# EAGLE design trunsmeetur (EAGLE 9.2.2)
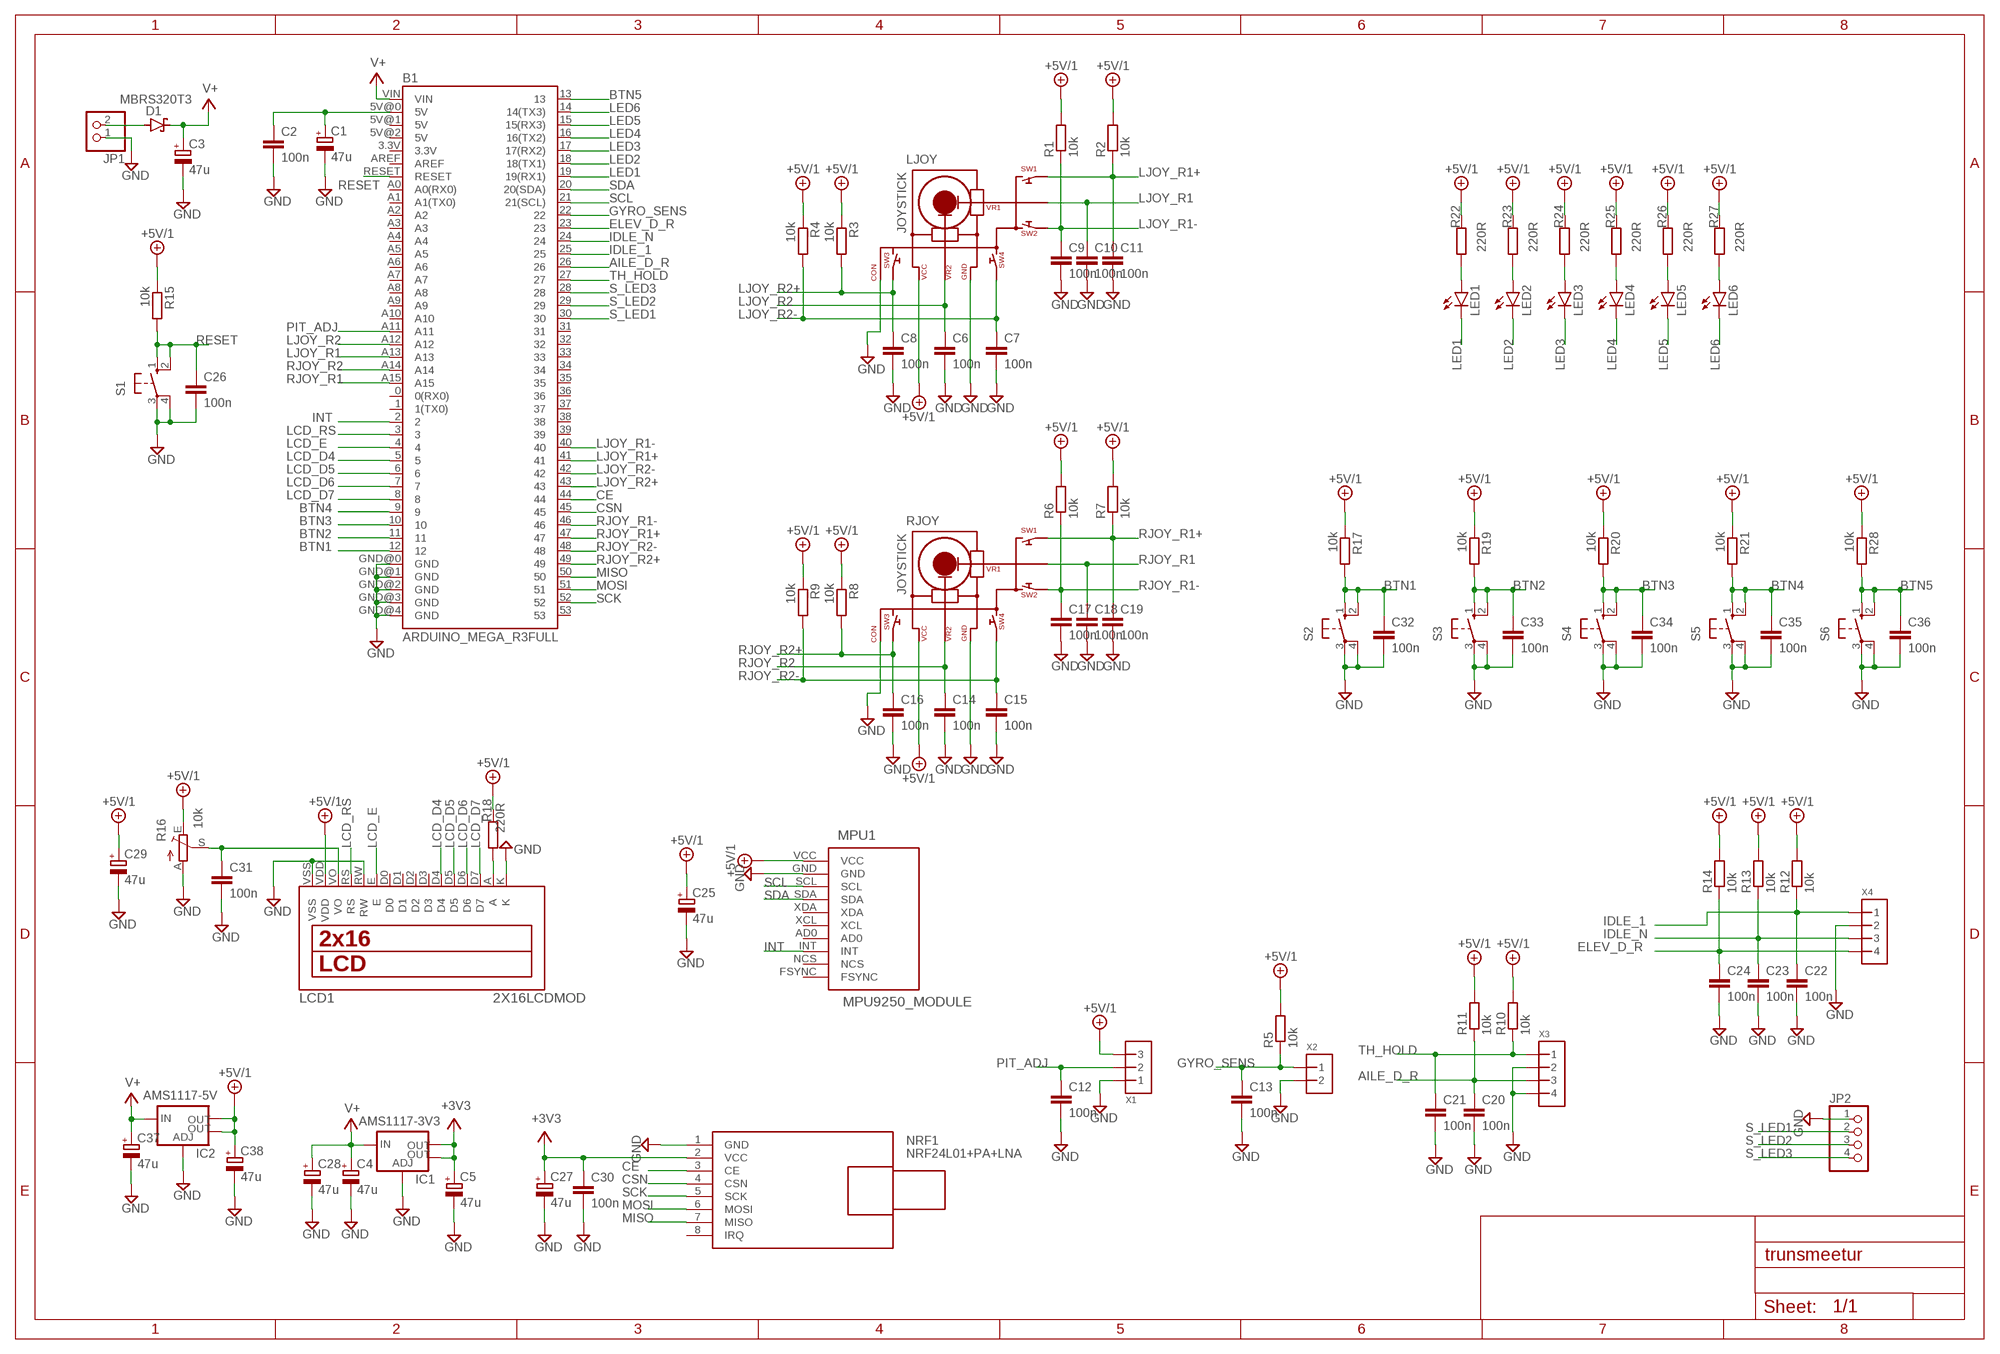
[diagram p0: schematic, sheet 1]

## Parts
B1  ARDUINO_MEGA_R3FULL  [ARDUINO_MEGA]
C1  47u  CPOL-EU153CLV-0605  [153CLV-0605]
C2  100n  C-EUC0805  [C0805]
C3  47u  CPOL-EU153CLV-0605  [153CLV-0605]
C4  47u  CPOL-EU153CLV-0605  [153CLV-0605]
C5  47u  CPOL-EU153CLV-0605  [153CLV-0605]
C6  100n  C-EUC0805  [C0805]
C7  100n  C-EUC0805  [C0805]
C8  100n  C-EUC0805  [C0805]
C9  100n  C-EUC0805  [C0805]
C10  100n  C-EUC0805  [C0805]
C11  100n  C-EUC0805  [C0805]
C12  100n  C-EUC0805  [C0805]
C13  100n  C-EUC0805  [C0805]
C14  100n  C-EUC0805  [C0805]
C15  100n  C-EUC0805  [C0805]
C16  100n  C-EUC0805  [C0805]
C17  100n  C-EUC0805  [C0805]
C18  100n  C-EUC0805  [C0805]
C19  100n  C-EUC0805  [C0805]
C20  100n  C-EUC0805  [C0805]
C21  100n  C-EUC0805  [C0805]
C22  100n  C-EUC0805  [C0805]
C23  100n  C-EUC0805  [C0805]
C24  100n  C-EUC0805  [C0805]
C25  47u  CPOL-EU153CLV-0605  [153CLV-0605]
C26  100n  C-EUC0805  [C0805]
C27  47u  CPOL-EU153CLV-0605  [153CLV-0605]
C28  47u  CPOL-EU153CLV-0605  [153CLV-0605]
C29  47u  CPOL-EU153CLV-0605  [153CLV-0605]
C30  100n  C-EUC0805  [C0805]
C31  100n  C-EUC0805  [C0805]
C32  100n  C-EUC0805  [C0805]
C33  100n  C-EUC0805  [C0805]
C34  100n  C-EUC0805  [C0805]
C35  100n  C-EUC0805  [C0805]
C36  100n  C-EUC0805  [C0805]
C37  47u  CPOL-EU153CLV-0605  [153CLV-0605]
C38  47u  CPOL-EU153CLV-0605  [153CLV-0605]
D1  MBRS320T3  [SMC]
IC1  AMS1117-3V3  V_REG_LM1117SOT223  [SOT223]
IC2  AMS1117-5V  V_REG_LM1117SOT223  [SOT223]
JP1  PINHD-1X2  [1X02]
JP2  PINHD-1X4  [1X04]
LCD1  2X16LCDMOD  [LCD16X2MOD]
LED1  LEDCHIPLED_0805  [CHIPLED_0805]
LED2  LEDCHIPLED_0805  [CHIPLED_0805]
LED3  LEDCHIPLED_0805  [CHIPLED_0805]
LED4  LEDCHIPLED_0805  [CHIPLED_0805]
LED5  LEDCHIPLED_0805  [CHIPLED_0805]
LED6  LEDCHIPLED_0805  [CHIPLED_0805]
LJOY  JOYSTICK  [JOYSTICKCONNECTOR]
MPU1  MPU9250_MODULE  [MPU9250_MODULE]
NRF1  NRF24L01+PA+LNA  WIRELESS-NRF24L01-PA-EXT  [WIRELESS-NRF24L01-PA-EXT]
R1  10k  R-EU_M0805  [M0805]
R2  10k  R-EU_M0805  [M0805]
R3  10k  R-EU_M0805  [M0805]
R4  10k  R-EU_M0805  [M0805]
R5  10k  R-EU_M0805  [M0805]
R6  10k  R-EU_M0805  [M0805]
R7  10k  R-EU_M0805  [M0805]
R8  10k  R-EU_M0805  [M0805]
R9  10k  R-EU_M0805  [M0805]
R10  10k  R-EU_M0805  [M0805]
R11  10k  R-EU_M0805  [M0805]
R12  10k  R-EU_M0805  [M0805]
R13  10k  R-EU_M0805  [M0805]
R14  10k  R-EU_M0805  [M0805]
R15  10k  R-EU_M0805  [M0805]
R16  10k  TRIM_EU-CA9V  [CA9V]
R17  10k  R-EU_M0805  [M0805]
R18  220R  R-EU_M0805  [M0805]
R19  10k  R-EU_M0805  [M0805]
R20  10k  R-EU_M0805  [M0805]
R21  10k  R-EU_M0805  [M0805]
R22  220R  R-EU_M0805  [M0805]
R23  220R  R-EU_M0805  [M0805]
R24  220R  R-EU_M0805  [M0805]
R25  220R  R-EU_M0805  [M0805]
R26  220R  R-EU_M0805  [M0805]
R27  220R  R-EU_M0805  [M0805]
R28  10k  R-EU_M0805  [M0805]
RJOY  JOYSTICK  [JOYSTICKCONNECTOR]
S1  10-XX  [B3F-10XX]
S2  10-XX  [B3F-10XX]
S3  10-XX  [B3F-10XX]
S4  10-XX  [B3F-10XX]
S5  10-XX  [B3F-10XX]
S6  10-XX  [B3F-10XX]
X1  3PIN  [3PINCONNECTOR]
X2  2PIN  [2PINCONNECTOR]
X3  4PIN  [4PINCONNECTOR]
X4  4PIN  [4PINCONNECTOR]

## Nets
+3V3: C5.+ C27.+ C30.1 IC1.2(OUT) IC1.4(OUT) NRF1.2(VCC)
+5V/1: C25.+ C29.+ C38.+ IC2.2(OUT) IC2.4(OUT) LCD1.VDD LJOY.VCC MPU1.VCC R1.2 R2.2 R3.1 R4.1 R5.2 R6.2 R7.2 R8.1 R9.1 R10.2 R11.2 R12.2 R13.2 R14.2 R15.1 R16.E R17.1 R18.1 R19.1 R20.1 R21.1 R22.1 R23.1 R24.1 R25.1 R26.1 R27.1 R28.1 RJOY.VCC X1.3
AILE_D_R: B1.26 C20.1 R11.1 X3.3
BTN1: B1.12 C32.1 R17.2 S2.1(S) S2.2(S1)
BTN2: B1.11 C33.1 R19.2 S3.1(S) S3.2(S1)
BTN3: B1.10 C34.1 R20.2 S4.1(S) S4.2(S1)
BTN4: B1.9 C35.1 R21.2 S5.1(S) S5.2(S1)
BTN5: B1.13 C36.1 R28.2 S6.1(S) S6.2(S1)
CE: B1.44 NRF1.3(CE)
CSN: B1.45 NRF1.4(CSN)
ELEV_D_R: B1.23 C24.1 R14.1 X4.4
GND: B1.GND@0(GND) B1.GND@1(GND) B1.GND@2(GND) B1.GND@3(GND) B1.GND@4(GND) C1.- C2.2 C3.- C4.- C5.- C6.2 C7.2 C8.2 C9.2 C10.2 C11.2 C12.2 C13.2 C14.2 C15.2 C16.2 C17.2 C18.2 C19.2 C20.2 C21.2 C22.2 C23.2 C24.2 C25.- C26.2 C27.- C28.- C29.- C30.2 C31.2 C32.2 C33.2 C34.2 C35.2 C36.2 C37.- C38.- IC1.1(ADJ) IC2.1(ADJ) JP1.1 JP2.1 LCD1.K LCD1.RW LCD1.VSS LJOY.CON LJOY.GND MPU1.GND NRF1.1(GND) R16.A RJOY.CON RJOY.GND S1.3(P) S1.4(P1) S2.3(P) S2.4(P1) S3.3(P) S3.4(P1) S4.3(P) S4.4(P1) S5.3(P) S5.4(P1) S6.3(P) S6.4(P1) X1.1 X2.2 X3.2 X3.4 X4.2
GYRO_SENS: B1.22 C13.1 R5.1 X2.1
IDLE_1: B1.25 C22.1 R12.1 X4.1
IDLE_N: B1.24 C23.1 R13.1 X4.3
INT: B1.2 MPU1.INT
LCD_D4: B1.5 LCD1.D4
LCD_D5: B1.6 LCD1.D5
LCD_D6: B1.7 LCD1.D6
LCD_D7: B1.8 LCD1.D7
LCD_E: B1.4 LCD1.E
LCD_RS: B1.3 LCD1.RS
LED1: B1.19(19(RX1)) LED1.C
LED2: B1.18(18(TX1)) LED2.C
LED3: B1.17(17(RX2)) LED3.C
LED4: B1.16(16(TX2)) LED4.C
LED5: B1.15(15(RX3)) LED5.C
LED6: B1.14(14(TX3)) LED6.C
LJOY_R1: B1.A13 C10.1 LJOY.VR1
LJOY_R1+: B1.41 C11.1 LJOY.SW1 R2.1
LJOY_R1-: B1.40 C9.1 LJOY.SW2 R1.1
LJOY_R2: B1.A12 C6.1 LJOY.VR2
LJOY_R2+: B1.43 C8.1 LJOY.SW3 R3.2
LJOY_R2-: B1.42 C7.1 LJOY.SW4 R4.2
MISO: B1.50 NRF1.7(MISO)
MOSI: B1.51 NRF1.6(MOSI)
N$1: C31.1 LCD1.VO R16.S
N$2: D1.A JP1.2
N$3: LCD1.A R18.2
N$4: LED1.A R22.2
N$5: LED2.A R23.2
N$6: LED3.A R24.2
N$7: LED4.A R25.2
N$8: LED5.A R26.2
N$9: LED6.A R27.2
N$19: B1.5V@0(5V) C1.+ C2.1
PIT_ADJ: B1.A11 C12.1 X1.2
RESET: B1.RESET C26.1 R15.2 S1.1(S) S1.2(S1)
RJOY_R1: B1.A15 C18.1 RJOY.VR1
RJOY_R1+: B1.47 C19.1 R7.1 RJOY.SW1
RJOY_R1-: B1.46 C17.1 R6.1 RJOY.SW2
RJOY_R2: B1.A14 C14.1 RJOY.VR2
RJOY_R2+: B1.49 C16.1 R8.2 RJOY.SW3
RJOY_R2-: B1.48 C15.1 R9.2 RJOY.SW4
S_LED1: B1.30 JP2.2
S_LED2: B1.29 JP2.3
S_LED3: B1.28 JP2.4
SCK: B1.52 NRF1.5(SCK)
SCL: B1.21(21(SCL)) MPU1.SCL
SDA: B1.20(20(SDA)) MPU1.SDA
TH_HOLD: B1.27 C21.1 R10.1 X3.1
V+: B1.VIN C3.+ C4.+ C28.+ C37.+ D1.C IC1.3(IN) IC2.3(IN)
Unconnected: B1.0(0(RX0)) B1.1(1(TX0)) B1.3.3V B1.5V@1(5V) B1.5V@2(5V) B1.31 B1.32 B1.33 B1.34 B1.35 B1.36 B1.37 B1.38 B1.39 B1.53 B1.A0(A0(RX0)) B1.A1(A1(TX0)) B1.A2 B1.A3 B1.A4 B1.A5 B1.A6 B1.A7 B1.A8 B1.A9 B1.A10 B1.AREF LCD1.D0 LCD1.D1 LCD1.D2 LCD1.D3 MPU1.AD0 MPU1.FSYNC MPU1.NCS MPU1.XCL MPU1.XDA NRF1.8(IRQ)

## Library data of the parts
B1 = SparkFun-Boards:ARDUINO_MEGA_R3: Arduino Mega R3 ATmega2560 R3 compatible footprint. SparkFun Products: Arduino Mega 2560 R3 <https://www.sparkfun.com/products/11061>
C1 C3-C5 C25 C27-C29 C37 C38 = rcl:CPOL-EU: POLARIZED CAPACITOR, European symbol; SPICEPREFIX: C
C2 C6-C24 C26 C30-C36 = rcl:C-EU: CAPACITOR, European symbol; SPICEPREFIX: C
D1 = diode:MBRS3*0T3: SCHOTTKY BARRIER RECTIFIER 3.0 AMPERES 20, 30, 40 VOLT Source: MBRS340T3-D.pdf
IC1 IC2 = SparkFun-IC-Power:V_REG_LM1117: Voltage Regulator LM1117 Standard adjustable voltage regulator but in SMD form. Spark Fun Electronics SKU : COM-00595; PROD_ID: VREG-08170
JP1 = pinhead:PINHD-1X2: PIN HEADER
JP2 = pinhead:PINHD-1X4: PIN HEADER
LCD1 = flightcontroller:2X16LCD
LED1-LED6 = led:LED: LED OSRAM: - CHIPLED LG R971, LG N971, LY N971, LG Q971, LY Q971, LO R971, LY R971 LH N974, LH R974 LS Q976, LO Q976, LY Q976 LO Q996 - Hyper CHIPLED LW Q18S LB Q993, LB Q99A, LB R99A - SideLED LS A670, LO A670, LY A670, LG A670, LP A670 LB A673, LV A673, LT A673, LW A673 LH A674 LY A675 LS A676, LA A676, LO A676, LY A676, LW A676 LS A679, LY A679, LG A679 - Hyper Micro SIDELED® LS Y876, LA Y876, LO Y876, LY Y876 LT Y87S - SmartLED LW L88C, LW L88S LB L89C, LB L89S, LG L890 LS L89K, LO L89K, LY L89K LS L896, LA L896, LO L896, LY L896 - TOPLED LS T670, LO T670, LY T670, LG T670, LP T670 LSG T670, LSP T670, LSY T670, LOP T670, LYG T670 LG T671, LOG T671, LSG T671 LB T673, LV T673, LT T673, LW T673 LH T674 LS T676, LA T676, LO T676, LY T676, LB T676, LH T676, LSB T676, LW T676 LB T67C, LV T67C, LT T67C, LS T67K, LO T67K, LY T67K, LW E67C LS E67B, LA E67B, LO E67B, LY E67B, LB E67C, LV E67C, LT E67C LW T67C LS T679, LY T679, LG T679 LS T770, LO T770, LY T770, LG T770, LP T770 LB T773, LV T773, LT T773, LW T773 LH T774 LS E675, LA E675, LY E675, LS T675 LS T776, LA T776, LO T776, LY T776, LB T776 LHGB T686 LT T68C, LB T68C - Hyper Mini TOPLED® LB M676 - Mini TOPLED Santana® LG M470 LS M47K, LO M47K, LY M47K Source: http://www.osram.convergy.de LUXEON: - LUMILED® LXK2-PW12-R00, LXK2-PW12-S00, LXK2-PW14-U00, LXK2-PW14-V00 LXK2-PM12-R00, LXK2-PM12-S00, LXK2-PM14-U00 LXK2-PE12-Q00, LXK2-PE12-R00, LXK2-PE12-S00, LXK2-PE14-T00, LXK2-PE14-U00 LXK2-PB12-K00, LXK2-PB12-L00, LXK2-PB12-M00, LXK2-PB14-N00, LXK2-PB14-P00, LXK2-PB14-Q00 LXK2-PR12-L00, LXK2-PR12-M00, LXK2-PR14-Q00, LXK2-PR14-R00 LXK2-PD12-Q00, LXK2-PD12-R00, LXK2-PD12-S00 LXK2-PH12-R00, LXK2-PH12-S00 LXK2-PL12-P00, LXK2-PL12-Q00, LXK2-PL12-R00 Source: www.luxeon.com KINGBRIGHT: KA-3528ASYC Source: www.kingbright.com
LJOY RJOY = flightcontroller:JOYSTICK
MPU1 = flightcontroller:MPU9250_MODULE
NRF1 = diy-modules:WIRELESS-NRF24L01-PA-EXT: 2.4 GHz Wireless Module based on NRF24L01 chip with preamplifier and external antenna Click here to find device on ebay.com <http://www.ebay.com/sch/nrf24l01+pa+lna+sma>
R1-R15 R17-R28 = rcl:R-EU_: RESISTOR, European symbol; SPICEPREFIX: R
R16 = pot:TRIM_EU-: POTENTIOMETER
S1-S6 = switch-omron:10-XX: OMRON SWITCH; MPN: B3F-1000; OC_FARNELL: 176432; OC_NEWARK: 36M3542
X1 = flightcontroller:3PIN
X2 = flightcontroller:2PIN
X3 X4 = flightcontroller:4PIN

## Board
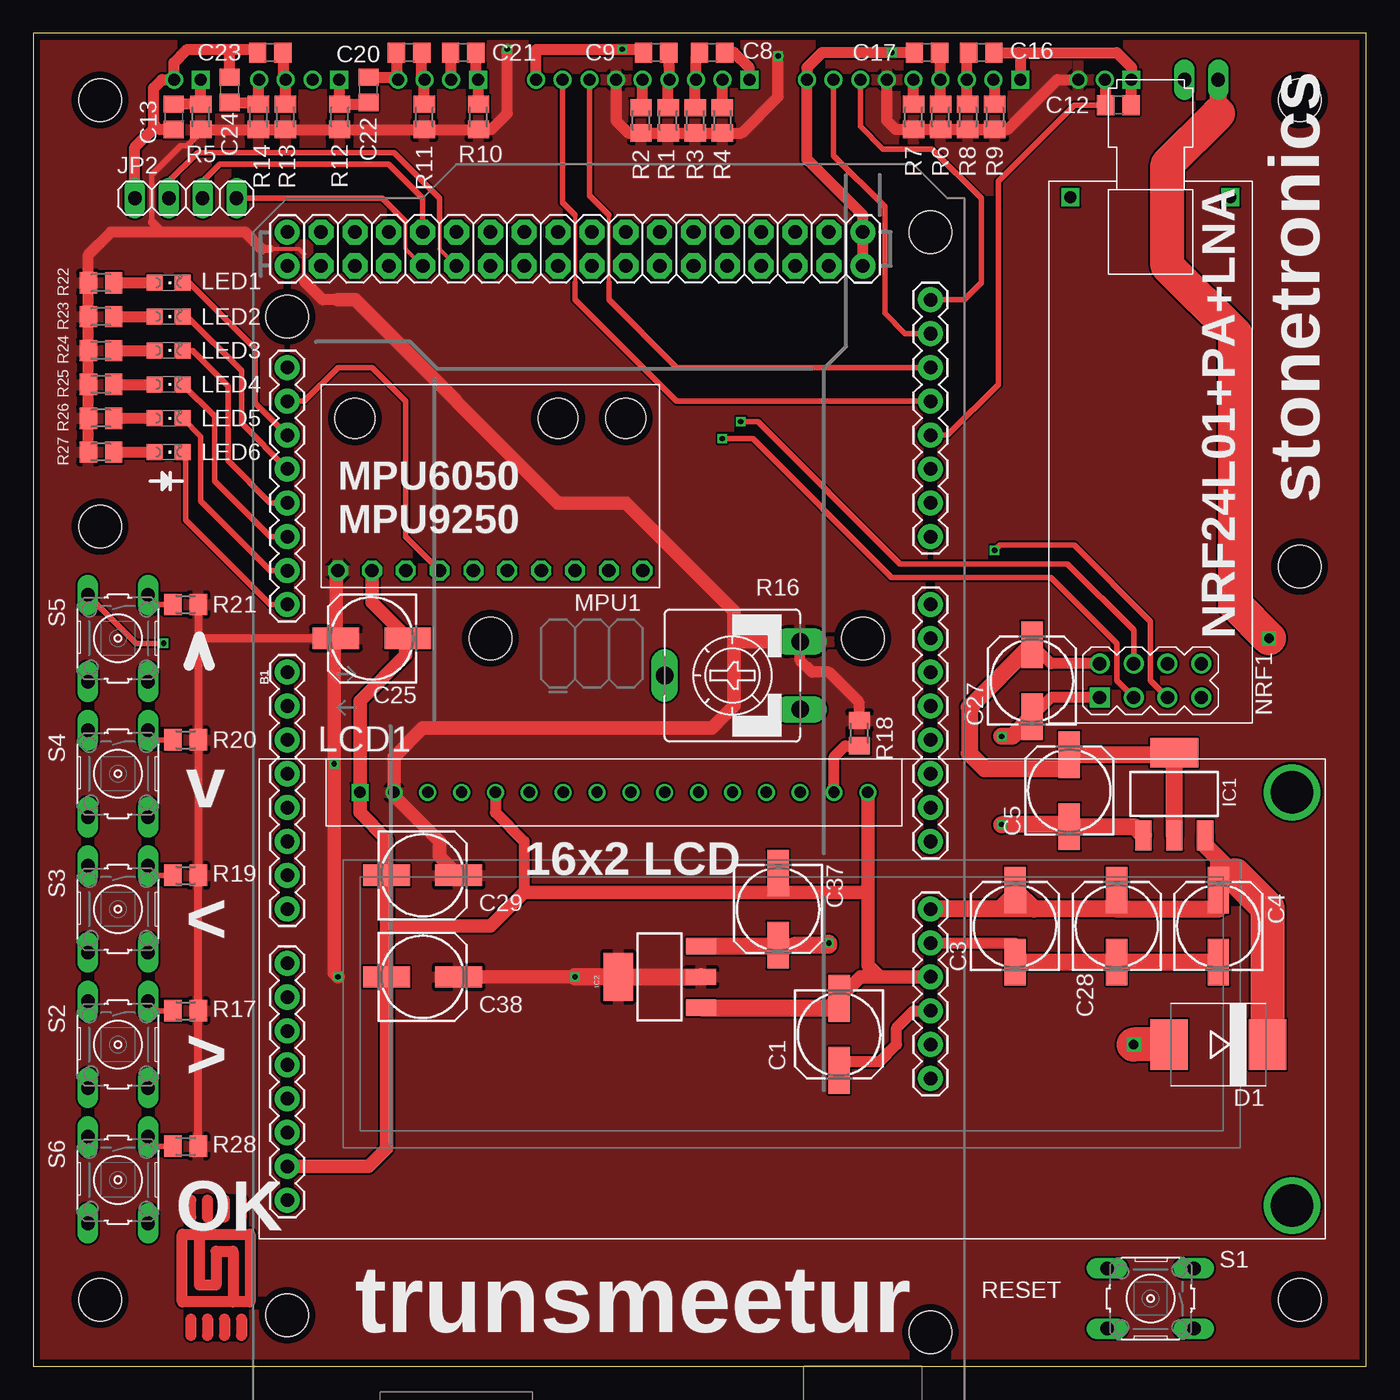
[diagram p1: board, top side]
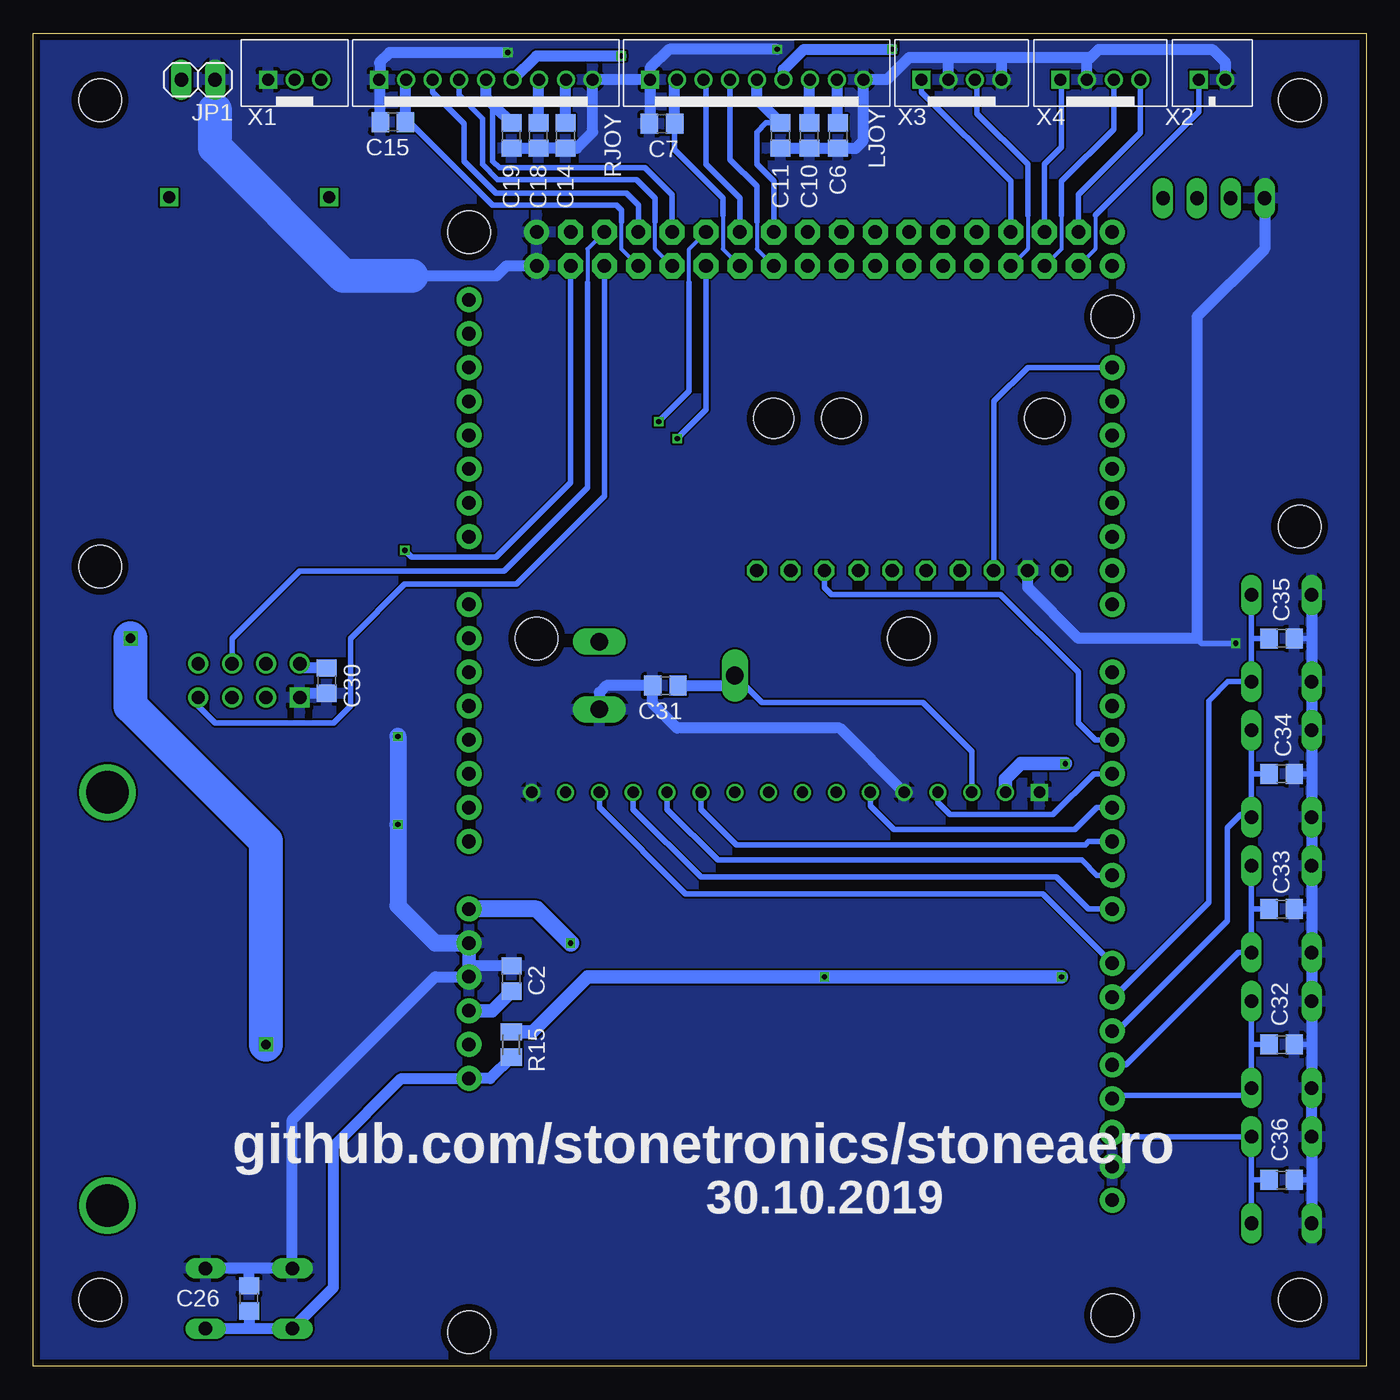
[diagram p2: board, bottom side, seen from below]

Size 100 x 100 mm. Coordinates in mm from the lower left corner, seen from the top.
Outline: 0,0 100,0 100,100 0,100 0,0
Copper layers (1*16): Top 0.035mm / dielectric 1.6mm / Bottom 0.035mm
Design rules "Elecrow_2-layer_PCB_eagle_rule": minimum track width 6mil, minimum drill 12mil, track to track 6mil, track to pad 6mil, pad to pad 6mil, via to via 8mil, smd to smd 0mil, copper to edge 20mil, drill to drill 10mil, minimum pad ring 6mil, minimum via ring 6mil, stop-mask expansion 0mil, vias tented up to drill 100mil, thermal gap 10mil
Holes 3.2 mm at 5,95 95,95 95,60 5,63 5,5 95,5
Holes 3 mm at 39.37,71.12

### Footprints (pad centres in the part's own frame; a part is rotated, then mirrored left to right if it is on the bottom)
ARDUINO_MEGA = drill 1.016 pad 1.88: 0 13.97,24.13; 1 11.43,24.13; 2 8.89,24.13; 3 6.35,24.13; 3.3V -13.97,-24.13; 4 3.81,24.13; 5 1.27,24.13; 5V@0 -11.43,-24.13; 5V@1 44.45,24.13; 5V@2 46.99,24.13; 6 -1.27,24.13; 7 -3.81,24.13; 8 -7.874,24.13; 9 -10.414,24.13; 10 -12.954,24.13; 11 -15.494,24.13; 12 -18.034,24.13; 13 -20.574,24.13; 14 19.05,24.13; 15 21.59,24.13; 16 24.13,24.13; 17 26.67,24.13; 18 29.21,24.13; 19 31.75,24.13; 20 34.29,24.13; 21 36.83,24.13; A0 1.27,-24.13; A1 3.81,-24.13; A2 6.35,-24.13; A3 8.89,-24.13; A4 11.43,-24.13; A5 13.97,-24.13; A6 16.51,-24.13; A7 19.05,-24.13; A8 24.13,-24.13; A9 26.67,-24.13; A10 29.21,-24.13; A11 31.75,-24.13; A12 34.29,-24.13; A13 36.83,-24.13; A14 39.37,-24.13; A15 41.91,-24.13; AREF -25.654,24.13; GND@0 -8.89,-24.13; GND@1 -6.35,-24.13; GND@2 44.45,-19.05; GND@3 46.99,-19.05; GND@4 -23.114,24.13; RESET -16.51,-24.13; VIN -3.81,-24.13 | drill 1.016 pad 1.88 octagon: 22 44.45,21.59; 23 46.99,21.59; 24 44.45,19.05; 25 46.99,19.05; 26 44.45,16.51; 27 46.99,16.51; 28 44.45,13.97; 29 46.99,13.97; 30 44.45,11.43; 31 46.99,11.43; 32 44.45,8.89; 33 46.99,8.89; 34 44.45,6.35; 35 46.99,6.35; 36 44.45,3.81; 37 46.99,3.81; 38 44.45,1.27; 39 46.99,1.27; 40 44.45,-1.27; 41 46.99,-1.27; 42 44.45,-3.81; 43 46.99,-3.81; 44 44.45,-6.35; 45 46.99,-6.35; 46 44.45,-8.89; 47 46.99,-8.89; 48 44.45,-11.43; 49 46.99,-11.43; 50 44.45,-13.97; 51 46.99,-13.97; 52 44.45,-16.51; 53 46.99,-16.51 | hole 3.2: -34.29,24.13; -35.56,-24.13; 16.51,8.89; 16.51,-19.05; 40.64,24.13; 46.99,-24.13
153CLV-0605 = smd 3.5 x 1.6: + 2.7,0; - -2.7,0
C0805 = smd 1.3 x 1.5: 1 -0.95,0; 2 0.95,0
SMC = smd 2.8 x 3.8: A 3.7,0; C -3.7,0
SOT223 = smd 1.219 x 2.235: 1 -2.311,-3.099; 2 0,-3.099; 3 2.311,-3.099 | smd 3.6 x 2.2: 4 0,3.099
1X02 = drill 1.016 long: 1 -1.27,0; 2 1.27,0
1X04 = drill 1.016 long: 1 -3.81,0; 2 -1.27,0; 3 1.27,0; 4 3.81,0
LCD16X2MOD = drill 0.85: A 40.64,0; D0 20.32,0; D1 22.86,0; D2 25.4,0; D3 27.94,0; D4 30.48,0; D5 33.02,0; D6 35.56,0; D7 38.1,0; E 17.78,0; K 43.18,0; RS 12.7,0; RW 15.24,0; VDD 7.62,0; VO 10.16,0 | drill 3.2: P$18 75,0; P$20 75,-31 | drill 0.85 square: VSS 5.08,0
CHIPLED_0805 = smd 1.2 x 1.2: A 0,-1.05; C 0,1.05
JOYSTICKCONNECTOR = drill 0.9 square: CON -8,0 | drill 0.9: GND 8,0; SW1 0,0; SW2 -2,0; SW3 -4,0; SW4 -6,0; VCC 2,0; VR1 4,0; VR2 6,0
MPU9250_MODULE = drill 1 octagon: AD0 0,-3.81; FSYNC 0,-11.43; GND 0,8.89; INT 0,-6.35; NCS 0,-8.89; SCL 0,6.35; SDA 0,3.81; VCC 0,11.43; XCL 0,-1.27; XDA 0,1.27 | hole 3: 11.43,10.16; 11.43,-10.16
WIRELESS-NRF24L01-PA-EXT = drill 1 square: 1 -18.415,3.81 | drill 1: 2 -15.875,3.81; 3 -18.415,1.27; 4 -15.875,1.27; 5 -18.415,-1.27; 6 -15.875,-1.27; 7 -18.415,-3.81; 8 -15.875,-3.81 | drill 0.9 square: P$1 19.125,6; P$2 19.125,-6
M0805 = smd 1.3 x 1.6: 1 -0.95,0; 2 0.95,0
CA9V = drill 1.321 long: A -2.54,-5.08; E 2.54,-5.08; S 0,5.08
B3F-10XX = drill 1.016 long: 1 -3.251,2.261; 2 3.251,2.261; 3 -3.251,-2.261; 4 3.251,-2.261
3PINCONNECTOR = drill 0.9 square: 1 -2,0 | drill 0.9: 2 0,0; 3 2,0
2PINCONNECTOR = drill 0.9 square: 1 -1,0 | drill 0.9: 2 1,0
4PINCONNECTOR = drill 0.9 square: 1 -3,0 | drill 0.9: 2 -1,0; 3 1,0; 4 3,0

### Placement (x,y rotation side)
B1  43.18,38.1 90 top
C1  60.45,24.89 270 top
C2  64.14,29.08 90 bottom
C3  73.66,33.02 90 top
C4  88.9,33.02 90 top
C5  77.72,43.18 90 top
C6  39.62,92.33 270 bottom
C7  52.83,93.22 180 bottom
C8  50.93,98.55 0 top
C9  46.74,98.55 180 top
C10  41.78,92.33 270 bottom
C11  43.94,92.33 270 bottom
C12  81.41,94.61 0 top
C13  10.54,93.73 270 top
C14  60.07,92.33 270 bottom
C15  73.03,93.34 180 bottom
C16  71.12,98.55 0 top
C17  67.06,98.55 180 top
C18  62.1,92.33 270 bottom
C19  64.14,92.33 270 bottom
C20  28.19,98.55 180 top
C21  32.26,98.55 180 top
C22  25.15,95.76 90 top
C23  17.78,98.55 180 top
C24  14.73,95.76 90 top
C25  25.4,54.61 180 top
C26  83.82,5.08 90 bottom
C27  74.93,51.44 90 top
C28  81.28,33.02 90 top
C29  29.21,36.83 0 top
C30  77.98,51.44 270 bottom
C31  52.58,51.05 180 bottom
C32  6.35,24.13 0 bottom
C33  6.35,34.29 0 bottom
C34  6.35,44.45 0 bottom
C35  6.35,54.61 0 bottom
C36  6.35,13.97 0 bottom
C37  55.88,34.29 270 top
C38  29.21,29.21 0 top
D1  88.9,24.13 180 top
IC1  85.6,42.93 0 top
IC2  46.99,29.21 90 top
JP1  87.63,96.52 180 bottom
JP2  11.43,87.63 0 top
LCD1  19.43,43.05 0 top
LED1  10.16,81.28 270 top
LED2  10.16,78.74 270 top
LED3  10.16,76.2 270 top
LED4  10.16,73.66 270 top
LED5  10.16,71.12 270 top
LED6  10.16,68.58 270 top
LJOY  45.72,96.52 0 bottom
MPU1  34.29,59.69 90 top
NRF1  83.82,68.58 90 top
R1  47.62,93.47 270 top
R2  45.59,93.47 270 top
R3  49.66,93.47 90 top
R4  51.69,93.47 90 top
R5  12.57,93.73 270 top
R6  68.07,93.73 270 top
R7  66.04,93.73 270 top
R8  70.1,93.73 90 top
R9  72.14,93.73 90 top
R10  33.4,93.73 270 top
R11  29.34,93.73 270 top
R12  22.99,93.73 270 top
R13  18.92,93.73 270 top
R14  16.89,93.73 270 top
R15  64.14,24.13 270 bottom
R16  52.45,51.82 90 top
R17  11.43,26.67 180 top
R18  61.98,47.5 270 top
R19  11.43,36.83 180 top
R20  11.43,46.99 180 top
R21  11.43,57.15 180 top
R22  5.08,81.28 0 top
R23  5.08,78.74 0 top
R24  5.08,76.2 0 top
R25  5.08,73.66 0 top
R26  5.08,71.12 0 top
R27  5.08,68.58 0 top
R28  11.43,16.51 180 top
RJOY  66.04,96.52 0 bottom
S1  83.82,5.08 180 top
S2  6.35,24.13 270 top
S3  6.35,34.29 270 top
S4  6.35,44.45 270 top
S5  6.35,54.61 270 top
S6  6.35,13.97 270 top
X1  80.39,96.52 0 bottom
X2  11.56,96.52 0 bottom
X3  30.35,96.52 0 bottom
X4  19.94,96.52 0 bottom

### Tracks (layer width: path | path; a pad name or v marks a point on that pad's centre or on a via)
+3V3
  Top 0.813: NRF1.2 76.36,52.7 C27.+
  Top 1.27: 85.45,45.88 C5.+ 77.72,44.83 71.37,44.83 70.23,45.97 70.23,49.44 C27.+ | 85.45,45.88 IC1.4 | IC1.2 85.6,45.73 85.45,45.88
  Bottom 0.813: C30.1 79.69,52.38 NRF1.2
+5V/1  (via drill 0.4)
  Top 0.305: 20.32,81.41 20.32,83.44 19.94,83.82 17.78,83.82
  Top 0.406: R5.2 12.57,92.58 11.56,91.57 11.05,91.57 8.89,89.41 8.89,85.85
  Top 0.61: 9.65,85.09 8.89,85.85 | R21.1 12.38,54.61 | 12.38,54.61 R20.1 R19.1 R17.1 R28.1 | C25.+ 12.38,54.61 | 17.78,83.82 17.14,83.82
  Top 0.813: LJOY.VCC 43.72,93.44 44.64,92.52 R2.2 R1.2 R3.1 R4.1 53.15,92.52 55.88,95.25 v55.88,98.3 | R9.1 R6.2 R7.2 64.7,92.78 64.01,93.47 64.04,93.5 RJOY.VCC | R9.1 73.09,92.78 76.83,96.52 X1.3 | R5.2 R14.2 R13.2 R12.2 R11.2 R10.2 34.36,92.78 35.56,93.98 v35.56,98.81 | R8.1 R9.1 | R18.1 61.98,49.78 59.69,52.07 58.42,52.07 57.53,52.96 R16.E | R27.1 R26.1 R25.1 R24.1 R23.1 R22.1 4.13,83.38 5.84,85.09 9.65,85.09 15.88,85.09 17.14,83.82 | 22.86,80.01 21.72,80.01 20.32,81.41
  Top 1.016: MPU1.VCC 22.7,59.53 C25.+ 22.57,54.48 v22.57,45.21 22.57,29.5 v22.86,29.21 | C29.+ 30.48,38.26 30.48,39.37 27.05,42.8 LCD1.VDD 27.05,45.72 29.21,47.88 50.93,47.88 52.58,49.53 52.58,54.36 | 52.58,54.36 R16.E | 52.58,54.36 52.58,56.64 44.45,64.77 39.37,64.77 24.13,80.01 22.86,80.01 | C38.+ v40.64,29.21
  Top 1.27: IC2.2 IC2.4 v40.64,29.21
  Bottom 0.813: v55.88,98.3 62.26,98.3 RJOY.VCC | v35.56,98.81 42.19,98.81 43.72,97.27 LJOY.VCC
  Bottom 1.016: v22.86,29.21 v40.64,29.21 58.42,29.21 62.55,25.08 R15.1 | LCD1.VDD 27.05,44.07 25.91,45.21 v22.57,45.21
  pour Top: 0,0 102.87,0 102.87,101.6 0,101.6
AILE_D_R
  Top 0.813: R11.1 29.34,96.5 X3.3 29.14,96.73 C20.1
  Bottom 0.305: 25.4,86.36 25.4,83.82 B1.26
  Bottom 0.406: X3.3 29.21,96.38 29.21,93.98 25.4,90.17 25.4,86.36
BTN1
  Top 0.406: R17.2 9.32,26.67 S2.1
  Bottom 0.406: S2.1 8.61,24.13 | 8.61,24.13 S2.2 9.17,20.32 18.8,20.32 B1.12 | C32.1 8.61,24.13
BTN2
  Top 0.406: R19.2 9.32,36.83 S3.1
  Bottom 0.406: S3.1 8.61,34.29 | 8.61,34.29 S3.2 9.6,31.04 12.7,27.94 12.95,27.69 18.03,22.61 B1.11 | C33.1 8.61,34.29
BTN3
  Top 0.406: R20.2 9.32,46.99 S4.1
  Bottom 0.406: S4.1 8.61,44.45 | 8.61,44.45 8.61,41.4 | 8.61,41.4 S4.2 | 8.61,41.4 9.4,41.4 10.41,40.39 10.41,33.4 18.67,25.15 B1.10 | C34.1 8.61,44.45
BTN4
  Top 0.406: R21.2 9.32,57.15 S5.1
  Bottom 0.406: S5.1 8.61,54.61 | 8.61,54.61 S5.2 10.36,51.36 11.81,49.91 11.81,34.8 18.92,27.69 B1.9 | C35.1 8.61,54.61
BTN5
  Top 0.406: S6.1 9.32,16.51 R28.2
  Bottom 0.406: S6.2 8.61,13.97 | 8.61,13.97 S6.1 18.75,17.22 B1.13 | C36.1 8.61,13.97
CE  (via drill 0.4)
  Top 0.406: NRF1.3 81.28,51.44 81.28,54.23 76.33,59.18 64.39,59.18 53.98,69.6 v51.69,69.6
  Bottom 0.406: v51.69,69.6 49.53,71.75 B1.44
CSN  (via drill 0.4)
  Top 0.406: NRF1.4 82.55,55.24 77.6,60.2 65.02,60.2 54.36,70.87 v53.09,70.87
  Bottom 0.305: 50.8,81.28 50.8,83.82 B1.45
  Bottom 0.406: v53.09,70.87 50.8,73.15 50.8,81.28
ELEV_D_R
  Top 0.813: X4.4 16.89,96.47 R14.1 16.76,94.81 C24.1
  Bottom 0.406: X4.4 16.94,92.53 21.59,87.88 B1.23
GND  (via drill 0.4)
  Top 0.406: S5.3 7.72,54.23 v9.78,54.23
  Top 0.813: LJOY.GND 37.72,98.81 v44.2,98.81 45.53,98.81 C9.2 | LJOY.CON 53.72,97.41 52.58,98.55 C8.2 | C16.2 73.91,98.55 | RJOY.CON 74.04,98.43 73.91,98.55 | 73.91,98.55 81.28,98.55 82.39,97.44 X1.1 82.39,94.65 C12.2 | C17.2 v64.39,98.55 59.18,98.55 58.04,97.41 RJOY.GND 58.04,90.55 62.23,86.36 B1.GND@3 B1.GND@2 | 14.73,98.81 11.56,98.81 10.56,97.81 X2.2 9.65,96.52 9.02,95.89 9.02,93.22 | C13.2 9.46,92.78 9.02,93.22 | X3.2 31.35,98.51 C21.2 | C24.2 14.73,98.81 | C22.2 27.16,96.71 X3.4 27.24,96.63 C20.2 | 14.73,98.81 16.58,98.81 C23.2 | JP2.1 7.62,91.44 9.02,92.84 9.02,93.22 | B1.GND@1 73.66,31.75 C3.- | NRF1.1 76.36,50.16 C27.- | LCD1.RW 34.67,41.53 36.83,39.37 36.83,35.56 | LCD1.K 62.61,35.56 62.61,30.48 | 62.61,30.1 62.61,29.59 62.23,29.21
  Top 1.016: MPU1.GND 25.4,57.31 C25.- 27.94,54.45 27.94,53.34 24.51,49.91 LCD1.VSS 24.51,41.53 26.51,39.53 C29.- 26.51,33.18 | B1.GND@4 25.15,14.99 26.51,16.35 C38.- 26.51,33.18 | 63.5,29.21 62.23,29.21 62.07,29.21 C1.- | 62.61,35.56 55.88,35.56 | 55.88,35.56 36.83,35.56 34.29,33.02 26.67,33.02 26.51,33.18 | 63.5,29.21 B1.GND@0 | 63.5,29.21 62.61,30.1 62.61,30.48 LCD1.K | C37.- 55.88,35.56
  Top 1.27: IC1.1 82.63,40.48 C5.- 77.56,40.64 v72.64,40.64 | C27.- 73.44,47.24 v72.64,47.24 | C3.- C28.- C4.- | IC2.1 59.76,26.9 C1.-
  Bottom 0.406: C32.2 4.09,24.13 | C33.2 4.09,34.29 | C34.2 4.09,44.45 | C35.2 4.09,54.61 | C36.2 4.09,13.97 | 12.7,54.61 12.32,54.23 v9.78,54.23
  Bottom 0.813: LJOY.GND 37.72,91.95 38.29,91.38 C6.2 C10.2 C11.2 | LJOY.GND | v44.2,98.81 52.32,98.81 53.72,97.41 LJOY.CON | LJOY.CON 53.72,93.28 C7.2 | C19.2 C18.2 C14.2 59.24,91.38 58.04,92.58 RJOY.GND LJOY.CON | C15.2 73.97,96.45 | 73.97,96.45 RJOY.CON | v64.39,98.55 73.28,98.55 74.04,97.79 73.97,97.72 73.97,96.45 | X3.2 31.35,98.16 31.37,98.17 | 27.35,98.17 X3.4 | 31.37,98.17 34.29,98.17 35.94,96.52 LJOY.GND | X4.2 20.94,97.93 20.7,98.17 | 20.7,98.17 20.07,98.81 11.56,98.81 10.54,97.79 10.56,97.77 X2.2 | 20.7,98.17 27.35,98.17 | 83.82,7.34 S1.4 80.57,18.49 69.85,29.21 B1.GND@0 67.31,30.03 C2.2 | 83.82,7.34 S1.3 | C26.2 83.82,7.34 | JP2.1 7.62,83.82 12.7,78.74 12.7,54.61 21.59,54.61 25.4,58.42 MPU1.GND | C30.2 79.69,50.48 NRF1.1 | B1.GND@2 64.52,82.55 65.28,81.79 71.63,81.79 | 27.35,98.17 31.37,98.17 | R16.A 57.53,50.55 57.02,51.05 C31.2 53.53,49.72 51.69,47.88 39.5,47.88 LCD1.RW | S5.3 4.09,54.61 S5.4 S4.3 4.09,44.45 S4.4 S3.3 4.09,34.29 S3.4 S2.3 4.09,24.13 S2.4 S6.3 4.09,13.97 S6.4
  Bottom 1.016: B1.GND@0 B1.GND@1
  Bottom 1.27: v72.64,47.24 v72.64,40.64 72.64,34.54 69.85,31.75 B1.GND@1 | 86.36,94.23 JP1.1
  Bottom 2.54: 71.63,81.79 76.71,81.79 86.36,91.44 86.36,94.23
  pour Bottom: 0,0 100.33,0 100.33,100.33 0,100.33
GYRO_SENS
  Top 0.813: X2.1 12.57,96.5 R5.1 C13.1
  Bottom 0.305: 20.32,86.36 20.32,83.82 B1.22
  Bottom 0.406: X2.1 12.56,94.12 20.32,86.36
IDLE_1
  Top 0.813: X4.1 22.99,96.47 R12.1 25.01,94.68 C22.1
  Bottom 0.406: B1.25 24.13,90.17 22.86,91.44 22.86,96.44 X4.1
IDLE_N
  Top 0.813: R13.1 18.92,96.5 | 18.92,96.5 X4.3 | C23.1 18.73,96.7 18.92,96.5
  Bottom 0.305: 22.86,86.36 22.86,83.82 B1.24
  Bottom 0.406: X4.3 18.94,92.82 22.86,88.9 22.86,86.36
INT
  Bottom 0.406: MPU1.INT 40.64,58.42 40.13,57.91 27.43,57.91 21.59,52.07 21.59,48.26 20.32,46.99 B1.2
LCD_D4
  Bottom 0.406: B1.5 20.83,39.37 21.08,39.12 47.24,39.12 49.91,41.78 LCD1.D4
LCD_D5
  Bottom 0.406: B1.6 20.19,36.83 21.34,37.97 48.64,37.97 52.45,41.78 LCD1.D5
LCD_D6
  Bottom 0.406: B1.7 20.83,34.29 23.24,36.7 49.91,36.7 54.99,41.78 LCD1.D6
LCD_D7
  Bottom 0.406: B1.8 24.26,35.43 51.05,35.43 57.53,41.91 LCD1.D7
LCD_E
  Bottom 0.406: B1.4 20.19,41.91 21.84,40.26 35.43,40.26 37.21,42.04 LCD1.E
LCD_RS
  Bottom 0.406: LCD1.RS 32.13,42.29 31.24,41.4 23.5,41.4 20.45,44.45 B1.3
LED1
  Top 0.406: B1.19 16.64,72.26 16.64,76.33 11.68,81.28 LED1.C
LED2
  Top 0.406: LED2.C 11.56,78.74 15.62,74.68 15.62,70.74 B1.18
LED3
  Top 0.406: LED3.C 11.94,76.2 14.61,73.53 14.61,67.94 17.78,64.77 B1.17
LED4
  Top 0.406: LED4.C 13.59,71.28 13.59,66.42 17.78,62.23 B1.16
LED5
  Top 0.406: LED5.C 12.57,69.76 12.57,64.9 17.78,59.69 B1.15
LED6
  Top 0.406: LED6.C 11.43,68.36 11.43,63.5 17.78,57.15 B1.14
LJOY_R1
  Top 0.305: 43.18,81.28 43.18,86.36
  Top 0.406: B1.A13 48.26,74.93 43.18,80.01 43.18,81.28 | 43.18,86.36 41.72,87.82 LJOY.VR1
  Bottom 0.813: C10.1 41.78,96.46 LJOY.VR1
LJOY_R1+
  Top 0.813: R2.1 45.72,94.55 LJOY.SW1
  Bottom 0.406: B1.41 44.45,88.9 45.72,90.17 45.72,92.58 45.02,93.28 C11.1
  Bottom 0.813: C11.1 45.72,95.06 LJOY.SW1
LJOY_R1-
  Top 0.813: R1.1 47.62,96.42 LJOY.SW2 47.72,97.57 47.69,97.6 C9.1
  Bottom 0.305: 45.72,85.85 45.72,83.82 B1.40
  Bottom 0.406: LJOY.SW2 47.72,90.52 45.72,88.52 45.72,85.85
LJOY_R2
  Top 0.305: 40.64,86.36 40.64,81.28
  Top 0.406: LJOY.VR2 39.72,87.28 40.64,86.36 | 40.64,81.28 40.64,80.01 48.26,72.39 B1.A12
  Bottom 0.813: LJOY.VR2 39.72,93.38 C6.1
LJOY_R2+
  Top 0.813: R3.2 49.66,96.46 LJOY.SW3 49.72,98.3 C8.1
  Bottom 0.406: LJOY.SW3 49.53,96.33 49.53,90.17 46.99,87.63 B1.43
LJOY_R2-
  Top 0.813: R4.2 51.69,96.49 LJOY.SW4
  Bottom 0.305: 48.26,86.36 48.26,83.82 B1.42
  Bottom 0.406: C7.1 51.88,91.25 48.26,87.63 48.26,86.36
  Bottom 0.813: C7.1 51.88,96.36 LJOY.SW4
MISO
  Bottom 0.406: B1.50 57.15,65.28 63.75,58.67 72.14,58.67 76.2,54.61 76.2,49.53 77.47,48.26 86.36,48.26 87.63,49.53 NRF1.7
MOSI
  Bottom 0.305: B1.51 58.42,83.82 58.42,81.28
  Bottom 0.406: 58.42,81.28 58.42,65.91 64.67,59.66 80.03,59.66 85.09,54.61 NRF1.6
N$1
  Bottom 0.406: R16.S 45.34,49.78 33.27,49.78 29.59,46.1 LCD1.VO
  Bottom 0.813: C31.1 48.13,51.05 R16.S
N$2  (via drill 0.7)
  Top 1.27: 88.9,93.98 JP1.2
  Top 2.54: v92.71,54.61 90.17,57.15 90.17,77.47 85.09,82.55 85.09,90.17 88.9,93.98 | D1.A v82.55,24.13
  Bottom 2.54: v92.71,54.61 92.71,49.53 82.55,39.37 v82.55,24.13
N$3
  Top 0.813: LCD1.A 60.07,45.72 60.9,46.55 R18.2
N$4
  Top 0.813: R22.2 LED1.A
N$5
  Top 0.813: R23.2 LED2.A
N$6
  Top 0.813: R24.2 LED3.A
N$7
  Top 0.813: R25.2 LED4.A
N$8
  Top 0.813: R26.2 LED5.A
N$9
  Top 0.813: R27.2 LED6.A
N$10
  Top 0.813: 12.45,9.91 11.18,9.91 11.18,4.83 14.99,4.83 | 12.45,9.91 16.26,9.91 16.26,4.83 14.99,4.83 | 12.45,9.91 12.45,6.1 13.72,6.1 13.72,8.64 14.99,8.64 14.99,4.83
N$11
  Top 0.813: 11.81,11.18 11.81,12.45
N$12
  Top 0.813: 13.08,11.18 13.08,12.45
N$13
  Top 0.813: 14.35,11.18 14.35,12.45
N$14
  Top 0.813: 15.62,11.18 15.62,12.45
N$15
  Top 0.813: 11.81,3.56 11.81,2.29
N$16
  Top 0.813: 13.08,3.56 13.08,2.29
N$17
  Top 0.813: 14.35,3.56 14.35,2.29
N$18
  Top 0.813: 15.62,3.56 15.62,2.29
N$19
  Top 0.813: C1.+ 61.12,22.86 63.5,22.86 64.77,24.13 64.77,25.4 66.04,26.67 B1.5V@0
  Bottom 1.016: C2.1 65.6,26.67 B1.5V@0
PIT_ADJ
  Top 0.406: B1.A11 68.58,69.85 72.39,73.66 72.39,88.9 78.11,94.61 C12.1
  Top 0.813: C12.1 80.46,96.45 X1.2
RESET
  Bottom 0.813: R15.2 65.72,21.59 B1.RESET 72.39,21.59 77.47,16.51 77.47,5.92 S1.2 83.82,2.82 | 83.82,2.82 S1.1 | C26.1 83.82,2.82
RJOY_R1
  Top 0.406: B1.A15 69.85,80.01 71.12,81.28 71.12,87.63 67.44,91.31 63.75,91.31 62.04,93.03 RJOY.VR1
  Bottom 0.813: C18.1 62.1,96.46 RJOY.VR1
RJOY_R1+
  Top 0.813: R7.1 RJOY.SW1
  Bottom 0.406: B1.47 52.07,87.88 54.1,89.92 65.02,89.92 65.53,90.42 65.53,94.23 65.31,94.45
  Bottom 0.813: C19.1 65.31,94.45 66.04,95.18 RJOY.SW1
RJOY_R1-
  Top 0.813: C17.1 68.04,98.52 RJOY.SW2 68.07,96.49 R6.1
  Bottom 0.305: B1.46 53.34,83.82 53.34,85.85
  Bottom 0.406: 53.34,85.85 53.34,87.63 54.74,89.03 65.15,89.03 66.29,90.17 66.29,93.6 68.07,95.38 68.07,96.49 RJOY.SW2
RJOY_R2
  Top 0.406: RJOY.VR2 60.04,90.84 63.88,87 63.88,78.99 65.41,77.47 B1.A14
  Bottom 0.813: C14.1 60.07,96.49 RJOY.VR2
RJOY_R2+
  Top 0.813: C16.1 70.04,98.42 RJOY.SW3 70.04,94.74 R8.2
  Bottom 0.406: B1.49 54.61,87.12 55.5,88.01 65.28,88.01 67.69,90.42 67.69,93.22 70.04,95.57 RJOY.SW3
RJOY_R2-
  Top 0.813: R9.2 72.14,96.42 RJOY.SW4
  Bottom 0.305: B1.48 55.88,83.82 55.88,85.85
  Bottom 0.406: 55.88,85.85 55.88,86.74 56.26,87.12 65.53,87.12 71.75,93.34 C15.1
  Bottom 0.813: C15.1 72.08,96.48 RJOY.SW4
S_LED1
  Top 0.305: 30.48,85.85 30.48,83.82 B1.30
  Top 0.406: JP2.2 10.16,88.9 12.32,91.06 27.05,91.06 30.48,87.63 30.48,85.85
S_LED2
  Top 0.406: JP2.3 12.7,88.9 13.97,90.17 26.67,90.17 29.21,87.63 B1.29
S_LED3
  Top 0.305: 27.94,85.85 27.94,83.82 B1.28
  Top 0.406: JP2.4 26.16,87.63 27.94,85.85
SCK  (via drill 0.4)
  Top 0.406: v72.14,61.21 72.52,61.59 78.11,61.59 83.82,55.88 83.82,51.44 NRF1.5
  Bottom 0.406: v72.14,61.21 71.63,60.71 65.28,60.71 59.69,66.29 B1.52
SCL
  Bottom 0.406: B1.21 25.4,74.93 27.94,72.39 MPU1.SCL
SDA
  Top 0.406: B1.20 20.32,72.39 22.86,74.93 25.4,74.93 27.94,72.39 27.94,62.23 MPU1.SDA
TH_HOLD
  Top 0.813: R10.1 33.4,96.47 X3.1 33.21,96.67 C21.1
  Bottom 0.406: B1.27 26.67,88.9 33.35,95.58 X3.1
V+  (via drill 0.4)
  Top 0.813: C3.+ 72.23,34.29 B1.VIN
  Top 1.016: C37.+ 57.15,31.59
  Top 1.27: C3.+ 75.09,34.29 | 81.28,34.29 75.09,34.29 | 75.09,34.29 B1.VIN | IC1.3 87.91,39.09 88.9,38.1 | 88.9,38.1 C4.+ 88.9,34.29 81.28,34.29 | C28.+ 81.28,34.29 | 90.17,36.83 88.9,38.1 | IC2.3 55.81,31.52 C37.+ | 57.15,31.59 59.69,31.59 v59.69,31.75
  Top 2.54: D1.C 92.6,34.4 90.17,36.83
  Bottom 1.27: B1.VIN 62.23,34.29 v59.69,31.75

### Text on the board
tPlace: stonetronics | MPU6050 / MPU9250 | NRF24L01+PA+LNA | v | 16x2 LCD | < | > | OK | RESET | trunsmeetur
bPlace: github.com/stonetronics/stoneaero | 30.10.2019